# Altium project QScreen.PrjPcb
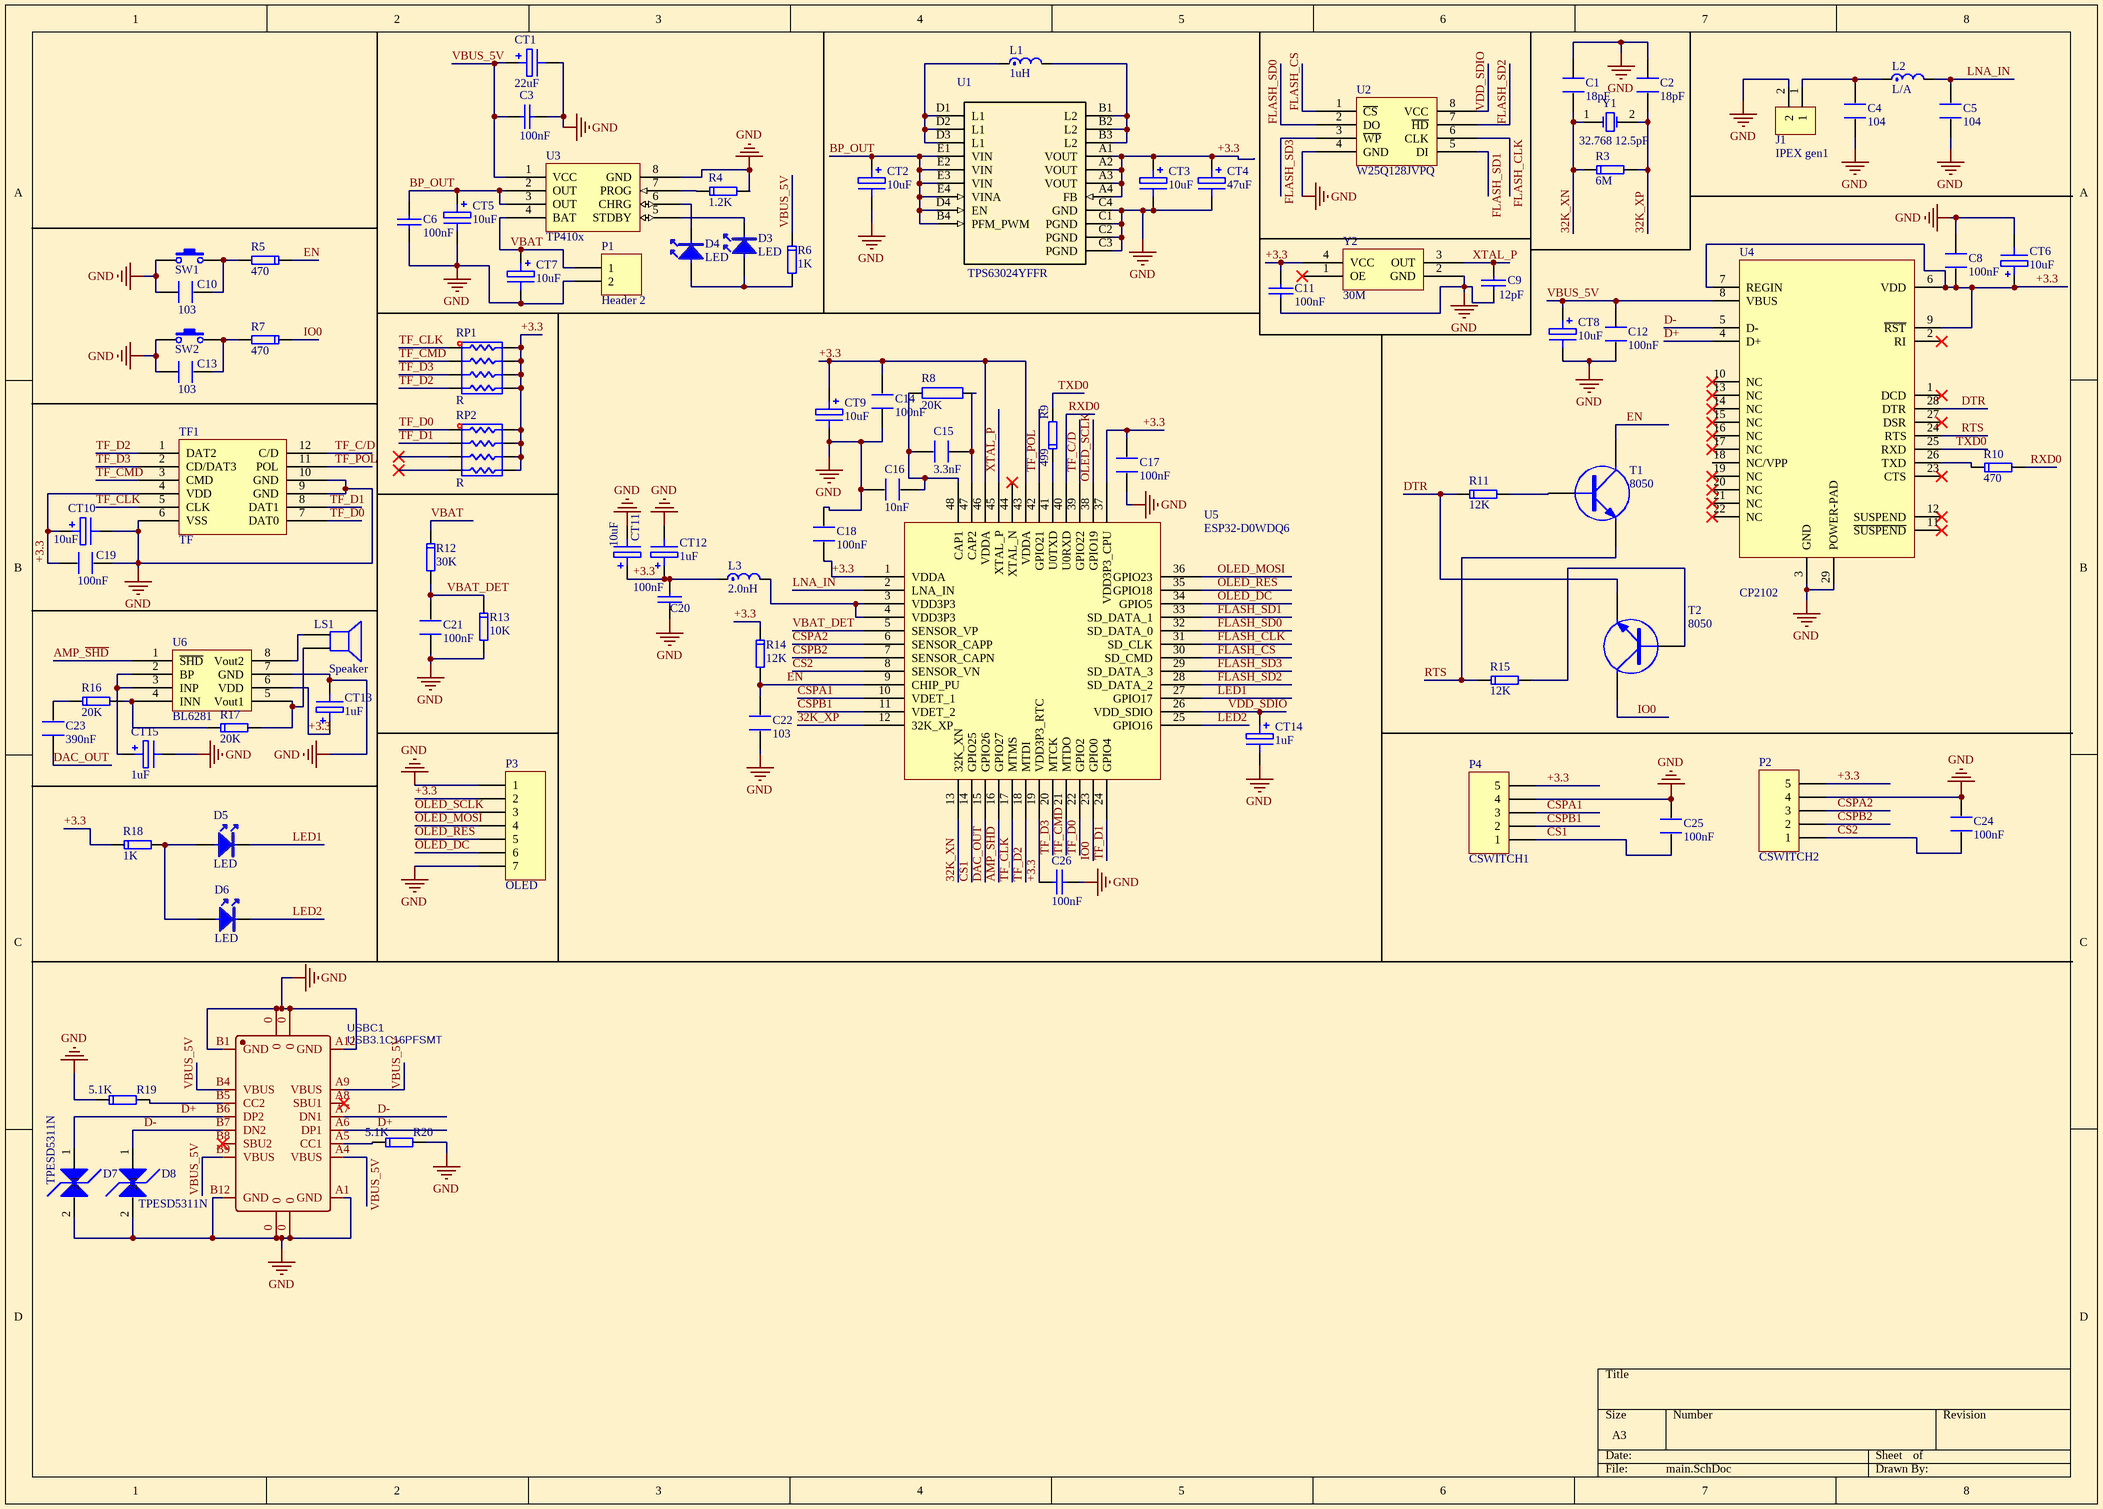
[diagram p0: main.SchDoc]
1 sheet, 89 parts. Net scope: global (net labels, ports and power ports of the same name join across sheets).
Board file: main.PcbDoc

## Sheet main.SchDoc
size A3

### Parts
C1  18pF  [C0603]
C2  18pF  [C0603]
C3  100nF  [C0603]
C4  104  [C0603]
C5  104  [C0603]
C6  100nF  [C0603]
C8  100nF  [C0603]
C9  12pF  [C0603]
C10  103  [C0603]
C11  100nF  [C0603]
C12  100nF  [C0603]
C13  103  [C0603]
C14  100nF  [C0603]
C15  3.3nF  [C0603]
C16  10nF  [C0603]
C17  100nF  [C0603]
C18  100nF  [C0603]
C19  100nF  [C0603]
C20  100nF  [C0603]
C21  100nF  [C0603]
C22  103  [C0603]
C23  390nF  [C0603]
C24  100nF  [C0603]
C25  100nF  [C0603]
C26  100nF  [C0603]
CT1  22uF  [C1206]
CT2  10uF  [C1206]
CT3  10uF  [C1206]
CT4  47uF  [C1206]
CT5  10uF  [C1206]
CT6  10uF  [C1206]
CT7  10uF  [C1206]
CT8  10uF  [C1206]
CT9  10uF  [C1206]
CT10  10uF  [C1206]
CT11  10uF  [C1206]
CT12  1uF  [C1206]
CT13  1uF  [C1206]
CT14  1uF  [C1206]
CT15  1uF  [C1206]
D3  LED  [LED_1206]
D4  LED  [LED_1206]
D5  LED  [LED_1206]
D6  LED  [LED_1206]
D7  TPESD5311N  [DFN1006-2]
D8  TPESD5311N  [DFN1006-2]
J1  IPEX gen1  [IPEX gen1]
L1  1uH  [L0520]
L2  L/A  [L0603]
L3  2.0nH  [L0603]
LS1  Speaker  [PIN2]
P1  Header 2  [HDR1X2]
P2  CSWITCH2  [HDR1X5]
P3  OLED  [HDR1X7]
P4  CSWITCH1  [HDR1X5]
R3  6M  [R0603]
R4  1.2K  [R0603]
R5  470  [R0603]
R6  1K  [R0603]
R7  470  [R0603]
R8  20K  [0603]
R9  499  [R0603]
R10  470  [R0603]
R11  12K  [R0603]
R12  30K  [R0603]
R13  10K  [R0603]
R14  12K  [R0603]
R15  12K  [R0603]
R16  20K  [R0603]
R17  20K  [R0603]
R18  1K  [R0603]
R19  5.1K  [R0603]
R20  5.1K  [R0603]
RP1  R  [RP4]
RP2  R  [RP4]
SW1  switch  [microswitch]  (value not drawn)
SW2  switch  [microswitch]  (value not drawn)
T1  8050  [STO-23]
T2  8050  [STO-23]
TF1  TF  [TF_3]
U1  TPS63024YFFR  [YFF0020AJAF]
U2  W25Q128JVPQ  [WSON-8_5x6mm]
U3  TP410x  [DFN-8_EP_3x3mm]
U4  CP2102  [QFN-28]
U5  ESP32-D0WDQ6  [QFN-48_6x6x04P]
U6  BL6281  [MSOP-8]
USBC1  USB3.1C16PFSMT  [TYPE-C-USB-17]
Y1  32.768 12.5pF  [SMD-3215_2P FC - 135]
Y2  30M  [SMD-2016-4P]

### Nets
GND: C1.1 C2.1 C3.2 C4.1 C5.1 C6.1 C8.2 C9.1 C10.1 C11.1 C12.1 C13.1 C14.1 C16.2 C17.1 C18.2 C19.1 C20.2 C21.2 C22.1 C24.1 C25.1 C26.2 CT1.2 CT2.2 CT3.2 CT4.2 CT5.2 CT6.2 CT7.2 CT8.2 CT9.2 CT10.2 CT11.2 CT12.2 CT13.2 CT14.2 CT15.2 D7.2 D8.2 J1.2 P1.2 P2.4 P3.1 P3.7 P4.4 R4.2 R13.2 R19.1 R20.2 SW1.1 SW2.1 TF1.6(VSS) TF1.9(GND) TF1.10(GND) U1.C1(PGND) U1.C2(PGND) U1.C3(PGND) U1.C4(GND) U2.4(GND) U3.8(GND) U4.3(GND) U4.29(POWER-PAD) U6.7(GND) USBC1.0 USBC1.A1(GND) USBC1.A12(GND) USBC1.B1(GND) USBC1.B12(GND) Y2.2(GND)
32K_XN: C1.2 R3.1 U5.13(32K_XN) Y1.1
32K_XP: C2.2 R3.2 U5.12(32K_XP) Y1.2
+3.3: C8.1 C11.2 C14.2 C17.2 C18.1 C19.2 C20.1 C26.1 CT3.1 CT4.1 CT6.1 CT9.1 CT10.1 CT11.1 CT12.1 CT13.1 L3.1 P2.5 P3.2 P4.5 R14.1 R18.1 RP1.5 RP1.6 RP1.7 RP1.8 RP2.5 RP2.6 RP2.7 RP2.8 TF1.4(VDD) U1.A1(VOUT) U1.A2(VOUT) U1.A3(VOUT) U1.A4(FB) U4.6(VDD) U4.7(REGIN) U4.9(~{RST}) U5.1(VDDA) U5.19(VDD3P3_RTC) U5.37(VDD3P3_CPU) U5.43(VDDA) U5.46(VDDA) U6.6(VDD) Y2.4(VCC)
AMP_~{SHD}: U5.16(GPIO27) U6.1(~{SHD})
BP_OUT: C6.2 CT2.1 CT5.1 U1.B4(PFM_PWM) U1.D4(EN) U1.E1(VIN) U1.E2(VIN) U1.E3(VIN) U1.E4(VINA) U3.2(OUT) U3.3(OUT)
CS1: C25.2 P4.1 U5.14(GPIO25)
CS2: C24.2 P2.1 U5.8(SENSOR_VN)
CSPA1: P4.3 U5.10(VDET_1)
CSPA2: P2.3 U5.6(SENSOR_CAPP)
CSPB1: P4.2 U5.11(VDET_2)
CSPB2: P2.2 U5.7(SENSOR_CAPN)
D+: D7.1 U4.4(D+) USBC1.A6(DP1) USBC1.B6(DP2)
D-: D8.1 U4.5(D-) USBC1.A7(DN1) USBC1.B7(DN2)
DAC_OUT: C23.1 U5.15(GPIO26)
DTR: R11.1 T2.1(E) U4.28(DTR)
EN: C22.2 R5.1 R14.2 T1.3(C) U5.9(CHIP_PU)
FLASH_CLK: U2.6(CLK) U5.31(SD_CLK)
FLASH_CS: U2.1(~{CS}) U5.30(SD_CMD)
FLASH_SD0: U2.2(DO) U5.32(SD_DATA_0)
FLASH_SD1: U2.5(DI) U5.33(SD_DATA_1)
FLASH_SD2: U2.7(~{HD}) U5.28(SD_DATA_2)
FLASH_SD3: U2.3(~{WP}) U5.29(SD_DATA_3)
IO0: R7.1 T2.3(C) U5.23(GPIO0)
LED1: D5.2 U5.27(GPIO17)
LED2: D6.2 U5.25(GPIO16)
LNA_IN: C5.2 L2.2 U5.2(LNA_IN)
OLED_DC: P3.6 U5.34(GPIO5)
OLED_MOSI: P3.4 U5.36(GPIO23)
OLED_RES: P3.5 U5.35(GPIO18)
OLED_SCLK: P3.3 U5.38(GPIO19)
RTS: R15.1 T1.1(E) U4.24(RTS)
RXD0: R10.2 U5.40(U0RXD)
TF_C/D: TF1.12(C/D) U5.39(GPIO22)
TF_CLK: RP1.1 TF1.5(CLK) U5.17(MTMS)
TF_CMD: RP1.2 TF1.3(CMD) U5.21(MTDO)
TF_D0: RP2.1 TF1.7(DAT0) U5.22(GPIO2)
TF_D1: RP2.2 TF1.8(DAT1) U5.24(GPIO4)
TF_D2: RP1.4 TF1.1(DAT2) U5.18(MTDI)
TF_D3: RP1.3 TF1.2(CD/DAT3) U5.20(MTCK)
TF_POL: TF1.11(POL) U5.42(GPIO21)
TXD0: R9.2 U4.25(RXD)
VBAT: CT7.1 P1.1 R12.1 U3.4(BAT)
VBAT_DET: C21.1 R12.2 R13.1 U5.5(SENSOR_VP)
VBUS_5V: C3.1 C12.2 CT1.1 CT8.1 R6.1 U3.1(VCC) U4.8(VBUS) USBC1.A4(VBUS) USBC1.A9(VBUS) USBC1.B4(VBUS) USBC1.B9(VBUS)
VDD_SDIO: CT14.1 U2.8(VCC) U5.26(VDD_SDIO)
XTAL_P: C9.2 U5.45(XTAL_P) Y2.3(OUT)
NetC4_2: C4.2 J1.1 L2.1
NetC10_2: C10.2 R5.2 SW1.2
NetC13_2: C13.2 R7.2 SW2.2
NetC15_1: C15.1 C16.1 R8.1 U5.48(CAP1)
NetC15_2: C15.2 R8.2 U5.47(CAP2)
NetC23_2: C23.2 R16.1
NetCT15_1: CT15.1 U6.2(BP) U6.3(INP)
NetD3_1: D3.1 D4.1 R6.2
NetD3_2: D3.2 U3.5(STDBY)
NetD4_2: D4.2 U3.6(CHRG)
NetD5_1: D5.1 D6.1 R18.2
NetL1_1: L1.1 U1.D1(L1) U1.D2(L1) U1.D3(L1)
NetL1_2: L1.2 U1.B1(L2) U1.B2(L2) U1.B3(L2)
NetL3_2: L3.2 U5.3(VDD3P3) U5.4(VDD3P3)
NetLS1_1: LS1.1 U6.8(Vout2)
NetLS1_2: LS1.2 R17.2 U6.5(Vout1)
NetR4_1: R4.1 U3.7(PROG)
NetR9_1: R9.1 U5.41(U0TXD)
NetR10_1: R10.1 U4.26(TXD)
NetR11_2: R11.2 T1.2(B)
NetR15_2: R15.2 T2.2(B)
NetR16_2: R16.2 R17.1 U6.4(INN)
NetR19_2: R19.2 USBC1.B5(CC2)
NetR20_1: R20.1 USBC1.A5(CC1)

Not connected (* = marked no-connect by the designer): RP2 3* 4*; U4 1(DCD)* 2(RI)* 10(NC)* 11(~{SUSPEND})* 12(SUSPEND)* 13(NC)* 14(NC)* 15(NC)* 16(NC)* 17(NC)* 18(NC/VPP) 19(NC)* 20(NC)* 21(NC)* 22(NC)* 23(CTS)* 27(DSR)*; U5 44(XTAL_N)*; USBC1 A8(SBU1)* B8(SBU2)*; Y2 1(OE)*

### Library data of the parts
C1 C2 C4 C5 C8 C10 C12-C19 C21-C25 = Capacitor
C3 C6 C9 C11 C20 C26 = CAP1
CT1-CT15 = CAP Tantalum
L1-L3 = INDUTOR
LS1 = Speaker: Loudspeaker; Published: 24-Mar-1999; LatestRevisionDate: 17-Jul-2002; LatestRevisionNote: Re-released for DXP Platform.; PackageReference: PIN2; Publisher: Altium Limited
P1 = Header 2: Header, 2-Pin; LatestRevisionDate: 17-Jul-2002; LatestRevisionNote: Re-released for DXP Platform.; Publisher: Altium Limited
P2 P4 = Header 5: Header, 5-Pin; LatestRevisionDate: 17-Jul-2002; LatestRevisionNote: Re-released for DXP Platform.; Publisher: Altium Limited
P3 = Header 7: Header, 7-Pin; LatestRevisionDate: 17-Jul-2002; LatestRevisionNote: Re-released for DXP Platform.; Publisher: Altium Limited
R3-R7 R9-R20 = Resistor
R8 = RES: 电阻
RP1 RP2 = RP4: Isolated Resistor Network; Published: 24-Mar-1999; LatestRevisionDate: 29-May-2009; LatestRevisionNote: IPC-7351 Footprint Added.; PackageReference: SO-16; Publisher: Altium Limited; PackageDescription: 16-Pin Small Outline Integrated Circuit 1.27 mm Pitch; Code_JEDEC: MS-012-AC; Code_IPC: SOIC127P600-16
SW1 SW2 = microswitch: 微动开关
T1 T2 = 8050: NPN型三极管; pin to pad: 1>2 2>1
TF1 = TF3
U1 = TPS63024YFFR: No Description Available; Alternate_PartNumber: TPS63024YFFT; Manufacturer: Texas Instruments; CompType: IC; PIN_COUNT: 20; PartNumber: TPS63024YFFR; PackageReference: YFF0020AJAF; MountType: SMT; RoHS: Y; RefDes: RefDes; Type: DEV; Value: Value; Copyright: Copyright (C) 2018 Accelerated Designs. All rights reserved
U4 = CP2102: USB to TTL
U6 = BL6281: 国产功放
Y1 = XTAL: Crystal Oscillator
Y2 = XTAL-SPXO: Simple Package Xtal Oscillator; Value: 30M